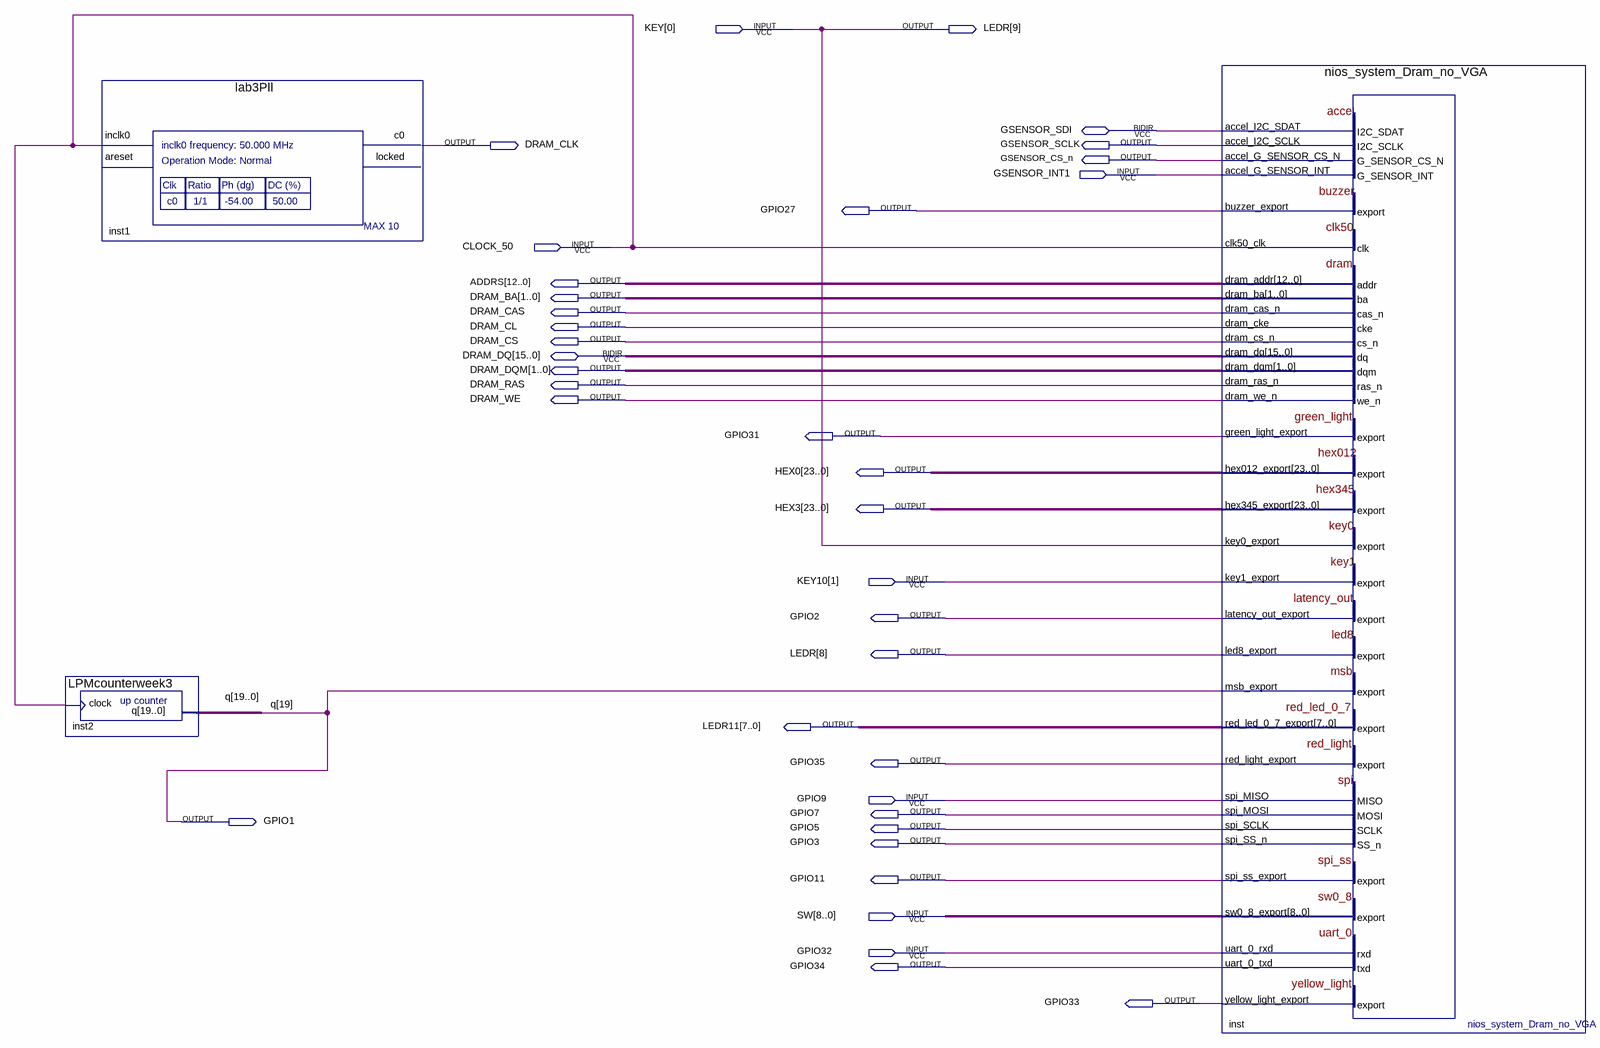
[diagram p0: schematic sheet]
// Quartus schematic Milestone1.bdf as structural Verilog: 3 symbols, 36 pins
module Milestone1 (
  input  [0:0] KEY,
  input  GSENSOR_INT1,
  input  CLOCK_50,
  input  [1:1] KEY10,
  input  GPIO9,
  input  [8:0] SW,
  input  GPIO32,
  inout  GSENSOR_SDI,
  inout  [15:0] DRAM_DQ,
  output [9:8] LEDR,
  output DRAM_CLK,
  output GSENSOR_SCLK,
  output GSENSOR_CS_n,
  output GPIO27,
  output [12:0] ADDRS,
  output [1:0] DRAM_BA,
  output DRAM_CAS,
  output DRAM_CL,
  output DRAM_CS,
  output [1:0] DRAM_DQM,
  output DRAM_RAS,
  output DRAM_WE,
  output GPIO31,
  output [23:0] HEX0,
  output [23:0] HEX3,
  output GPIO2,
  output [7:0] LEDR11,
  output GPIO35,
  output GPIO7,
  output GPIO1,
  output GPIO5,
  output GPIO3,
  output GPIO11,
  output GPIO34,
  output GPIO33
);

  wire [18:0] q;

  LPMcounterweek3 inst2 (.clock(CLOCK_50), .q({GPIO1, q}));
  lab3Pll inst1 (.inclk0(CLOCK_50), .c0(DRAM_CLK));  // open: areset, locked
  nios_system_Dram_no_VGA inst (
    .accel_G_SENSOR_INT(GSENSOR_INT1), .clk50_clk(CLOCK_50), .key0_export(KEY[0]), .key1_export(KEY10[1]),
    .msb_export(GPIO1), .spi_MISO(GPIO9), .sw0_8_export(SW), .uart_0_rxd(GPIO32),
    .accel_I2C_SCLK(GSENSOR_SCLK), .accel_G_SENSOR_CS_N(GSENSOR_CS_n), .buzzer_export(GPIO27),
    .dram_addr(ADDRS), .dram_ba(DRAM_BA), .dram_cas_n(DRAM_CAS), .dram_cke(DRAM_CL), .dram_cs_n(DRAM_CS),
    .dram_dqm(DRAM_DQM), .dram_ras_n(DRAM_RAS), .dram_we_n(DRAM_WE), .green_light_export(GPIO31),
    .hex012_export(HEX0), .hex345_export(HEX3), .latency_out_export(GPIO2), .led8_export(LEDR[8]),
    .red_led_0_7_export(LEDR11), .red_light_export(GPIO35), .spi_MOSI(GPIO7), .spi_SCLK(GPIO5),
    .spi_SS_n(GPIO3), .spi_ss_export(GPIO11), .uart_0_txd(GPIO34), .yellow_light_export(GPIO33),
    .accel_I2C_SDAT(GSENSOR_SDI), .dram_dq(DRAM_DQ));

  assign LEDR[9] = KEY[0];

  // Other names for the same wires on the sheet: q[19] = GPIO1
endmodule
